# EasyEDA Pro project PCB_Project.eprj

# Schematic Schematic1
Create Date: 2023-12-18; Page Name: P1; Project Name: PCB_Project; Schematic Name: Schematic1; Update Date: 2023-12-18; Company: 嘉立创EDA; Page Size: A4; Version: V1.0
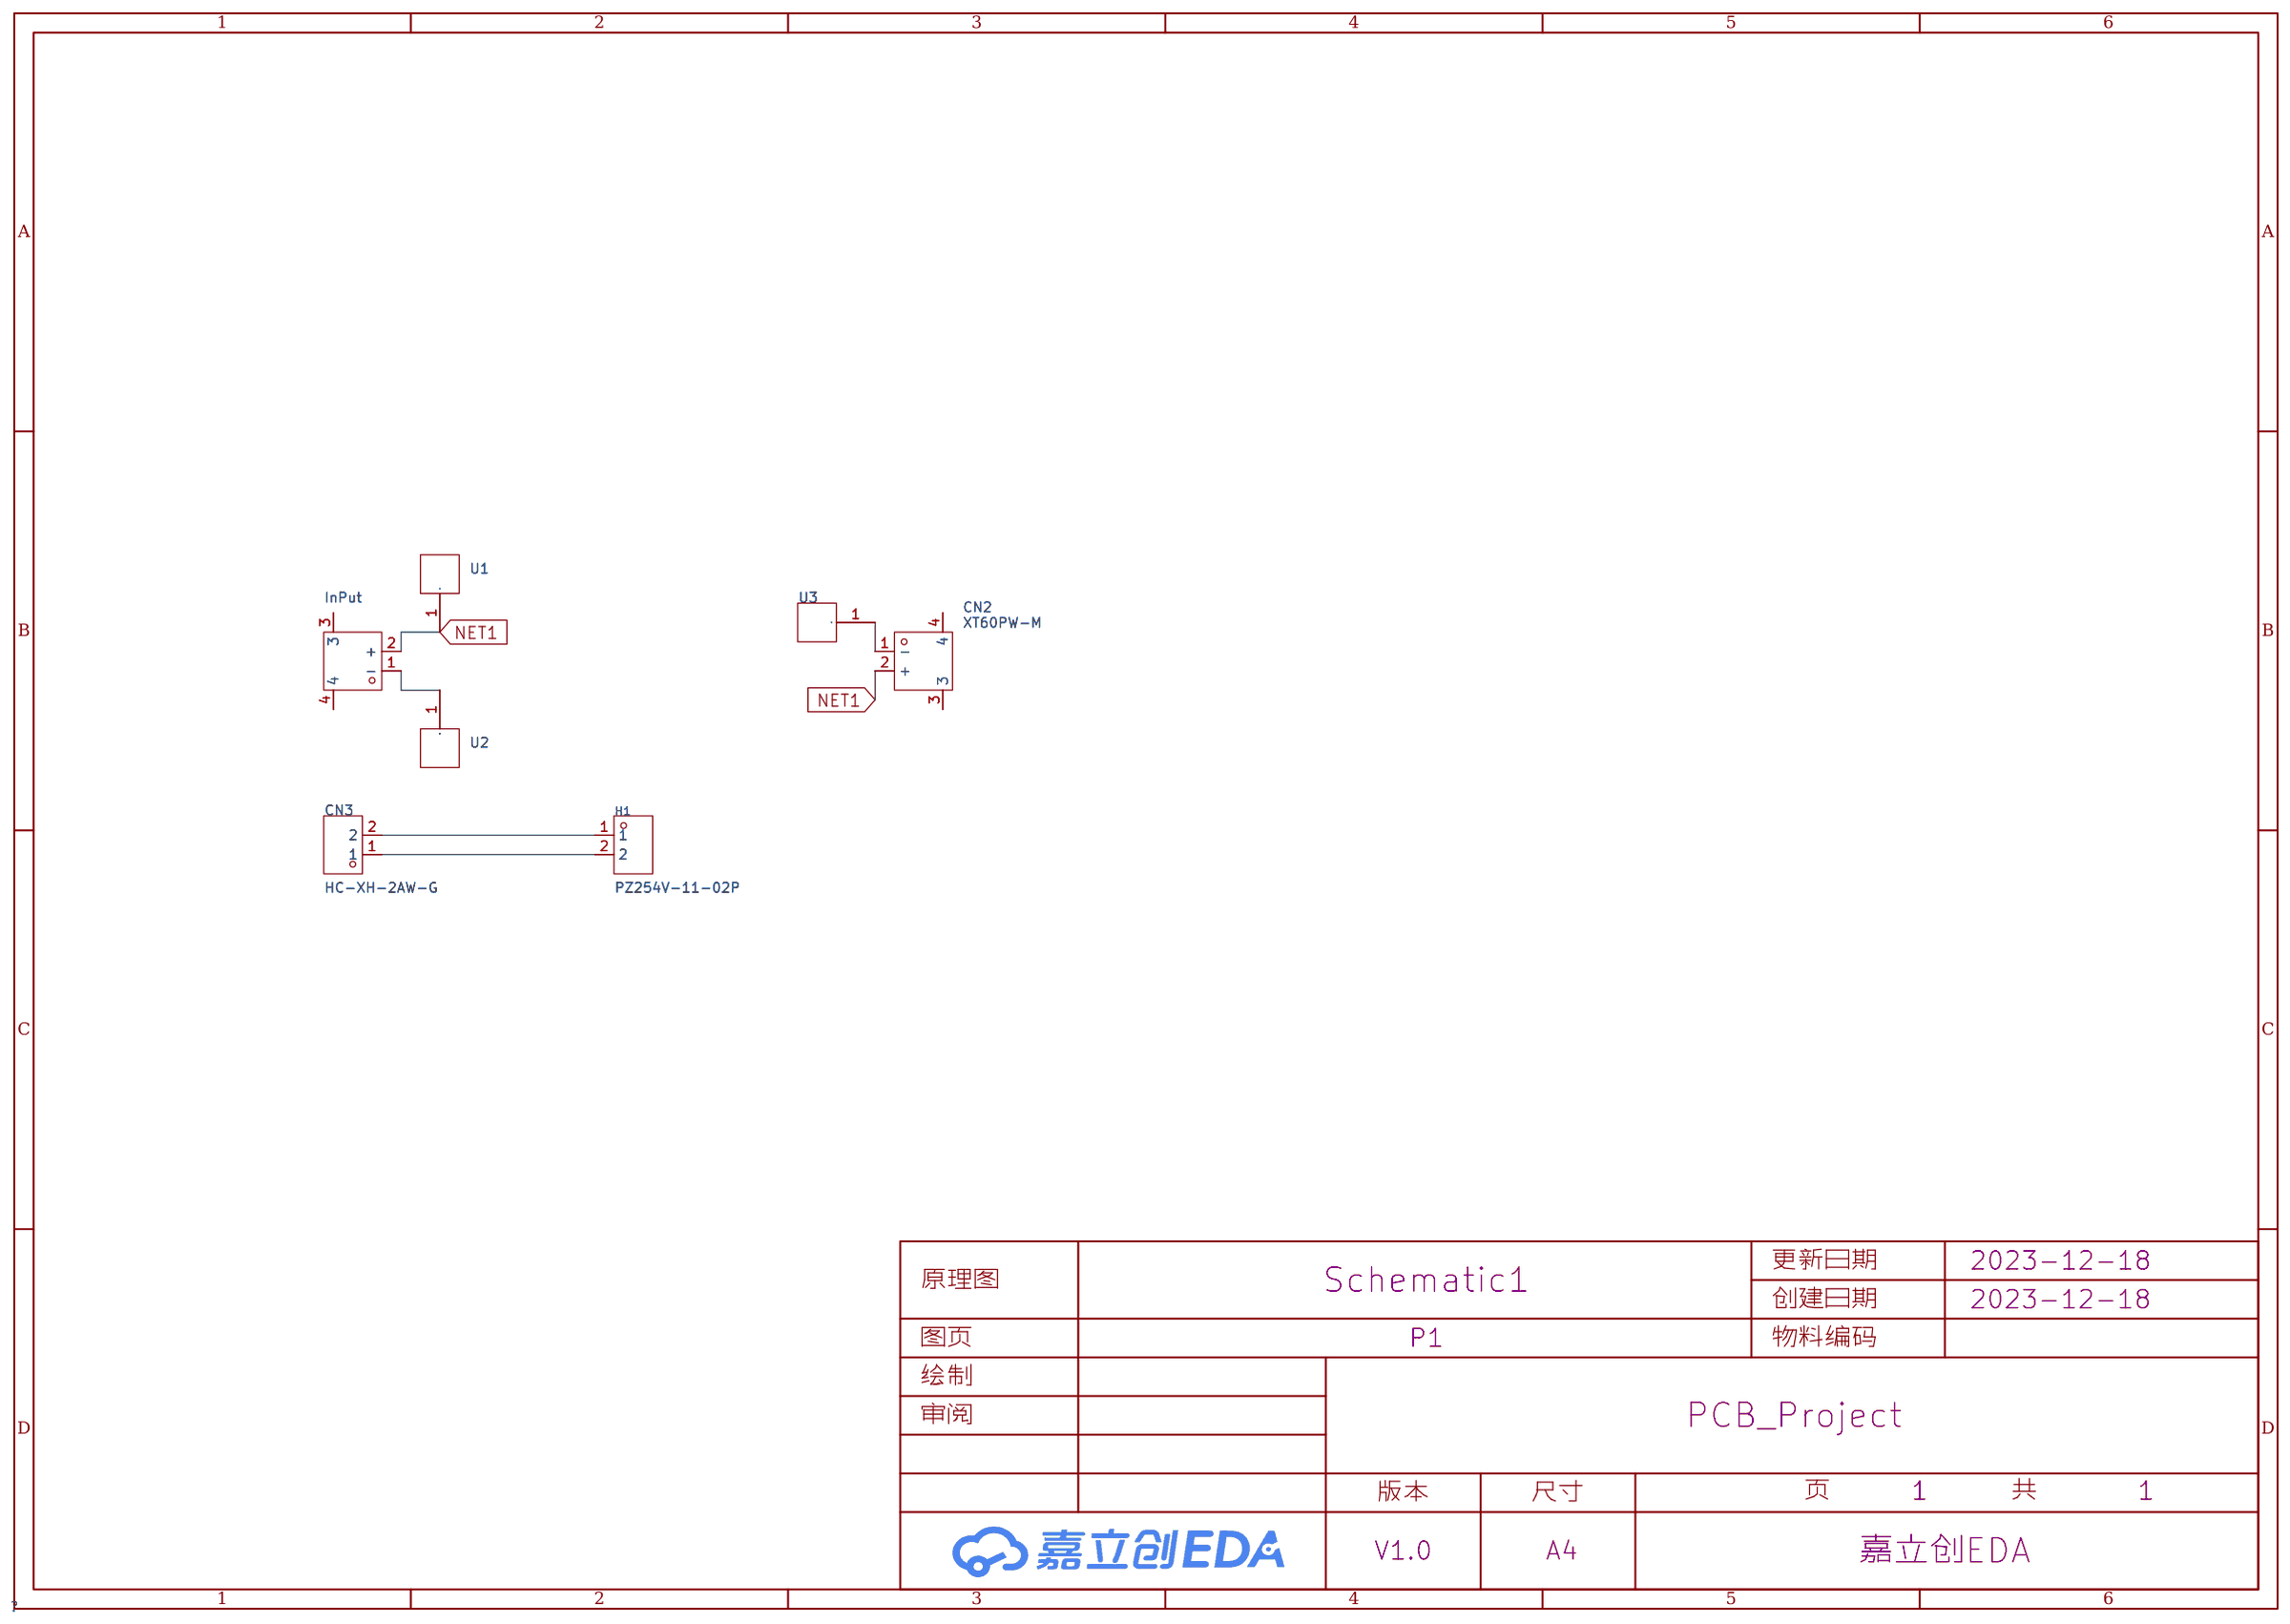
[diagram p0: schematic sheet]

## Parts
CN2  XT60PW-M  [CONN-TH_XT60PW-M]
CN3  HC-XH-2AW-G  [CONN-TH_2P-P2.50_HC-XH-2AW-G]
H1  PZ254V-11-02P  [HDR-TH_2P-P2.54-V-M]
InPut  XT60PW-M  [CONN-TH_XT60PW-M]
U1  -  [过孔焊盘(1Px3mm)]
U2  -  [过孔焊盘(1Px3mm)]
U3  -  [过孔焊盘(1Px3mm)]

## Library data of the parts
CN2 InPut = XT60PW-M: 类别:-;类型1:-;; LCSC Part Name: AMASS(艾迈斯)航模插头xt60连接器150公母对接pw锂电池公头 板插卧式XT60PW-M; Supplier Part: C98732; Manufacturer: AMASS(艾迈斯); JLCPCB Part Class: 扩展库; Datasheet: https://atta.szlcsc.com/upload/public/pdf/source/20190916/C428722_DFF78979486FCB0B58C1FC563067EC88.pdf; Supplier: LCSC; Brand: 艾迈斯; Type: 卧式插头; Colour: 黄色; InterfaceType: 公头
CN3 = HC-XH-2AW-G: 插针结构:1x2P;间距:2.54mm;安装方式:弯插;行距:2.54mm;总PIN数:2P;排数:1;每排PIN数:2;参考系列:XH;额定电流:3A;工作温度范围:-25℃~+85℃;; LCSC Part Name: 1x2P 间距:2.54mm 弯插 系列:XH; Supplier Part: C5341208; Manufacturer: HCTL(华灿天禄); Supplier Footprint: 弯插,P=2.5mm; JLCPCB Part Class: 扩展库; Datasheet: https://atta.szlcsc.com/upload/public/pdf/source/20230711/B565BAF3B11666EF6B81B3605408F2BD.pdf; Supplier: LCSC; Pins Structure: 1x2P; Pitch: 2.54mm; Mounting Style: 弯插; Row Spacing: 2.54mm; Number of Pins: 2P; Number of Rows: 1; Number of PINs Per Row: 2; Reference Series: XH; Current Rating (Max): 3A; Operating Temperature Range: -25℃~+85℃
H1 = PZ254V-11-02P: 排数:单排;总PIN位数:2P;间距:2.54mm;插针结构:1x2P;行距:-;安装类型:直插;圆针/方针:方针;额定电流:-;额定电压:-;配合针长度:6mm;塑高:2.5mm;端接针长度:3mm;触头材质:黄铜;触头镀层:-;工作温度范围:-40℃~+105℃;颜色:黑色;; LCSC Part Name: 2.54mm 1x2P 直插 方针; Supplier Part: C492401; Manufacturer: XFCN(兴飞); Supplier Footprint: 插件,P=2.54mm; JLCPCB Part Class: 扩展库; Datasheet: https://atta.szlcsc.com/upload/public/pdf/source/20200309/C492401_A812433581A9B211A7FFA413ADDFF0E5.pdf; Supplier: LCSC; Number of Rows: 单排; Number of Pins: 2P; Pitch: 2.54mm; Pin Structure: 1x2P; Mounting Type: 直插; Circluar Pins/Square Pins: 方针; Length of Mating Pin: 6mm; Insulation Height: 2.5mm; Length of End Connection Pin: 3mm; Contact Material: 黄铜; Operating Temperature Range: -40℃~+105℃; Color: 黑色
U1-U3 = 过孔焊盘(1Px3mm)

## Nets
NET1: CN2.2(+) InPut.2(+) U1.1
$1N274: InPut.1(-) U2.1
$1N486: CN3.2 H1.1
$1N489: CN3.1 H1.2
Net-(CN2-1): CN2.1(-) U3.1

Not connected (* = marked no-connect by the designer): CN2 3 4; InPut 3 4

# Board PCB1
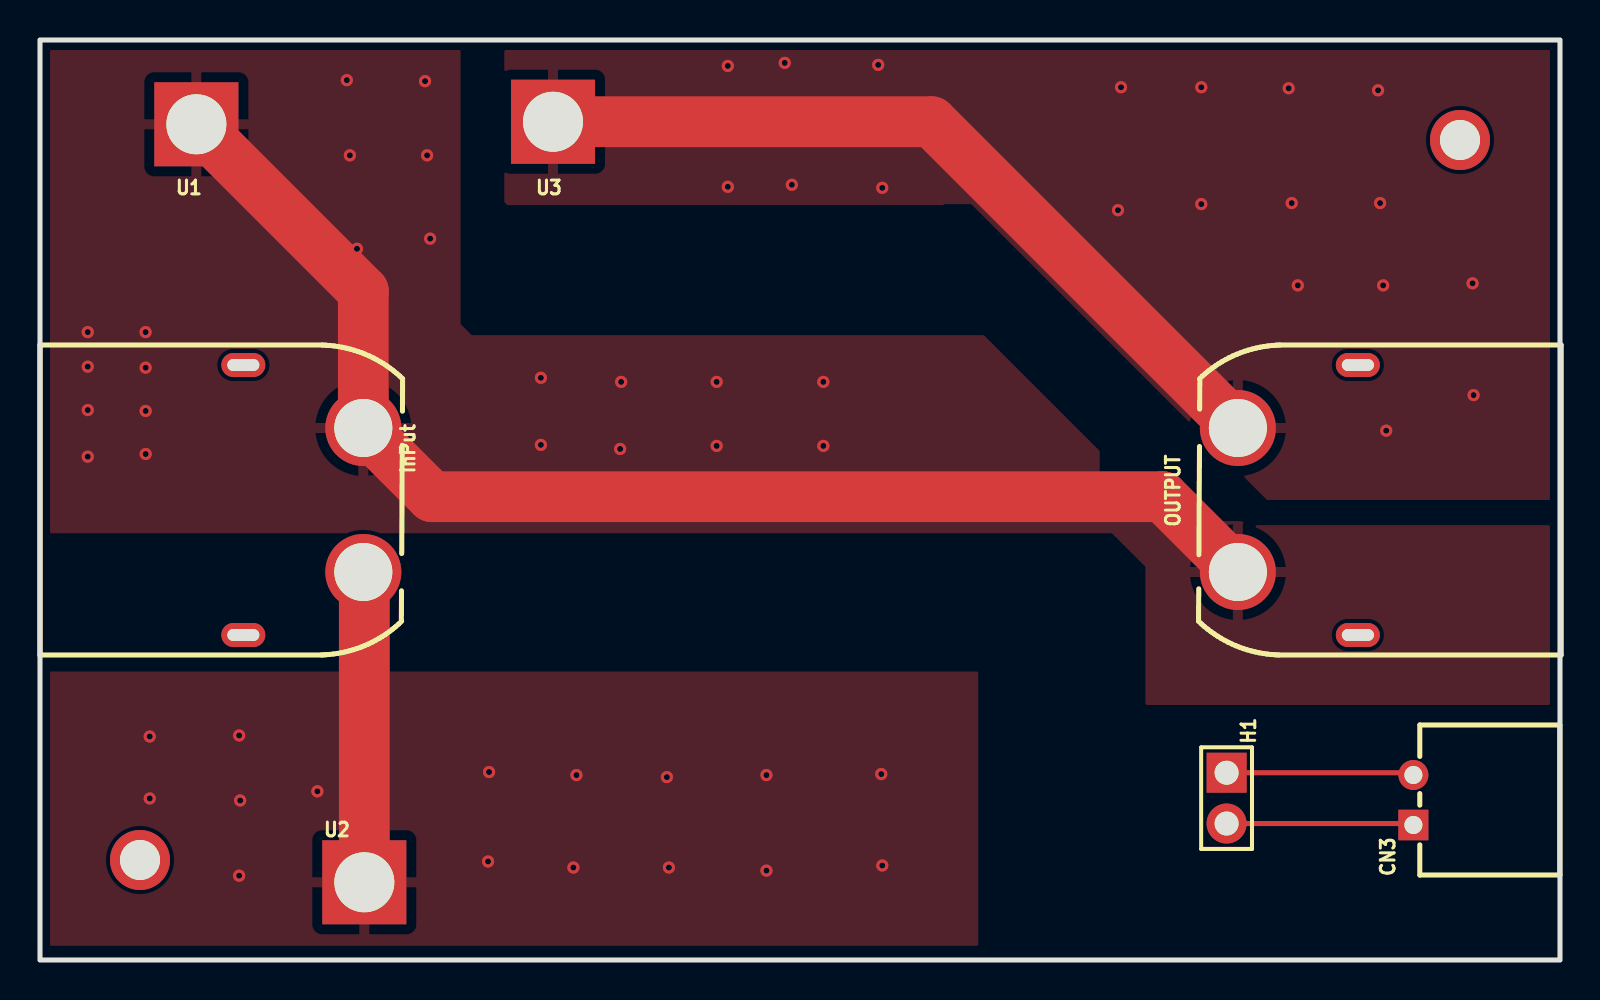
[diagram p1: board, top side]
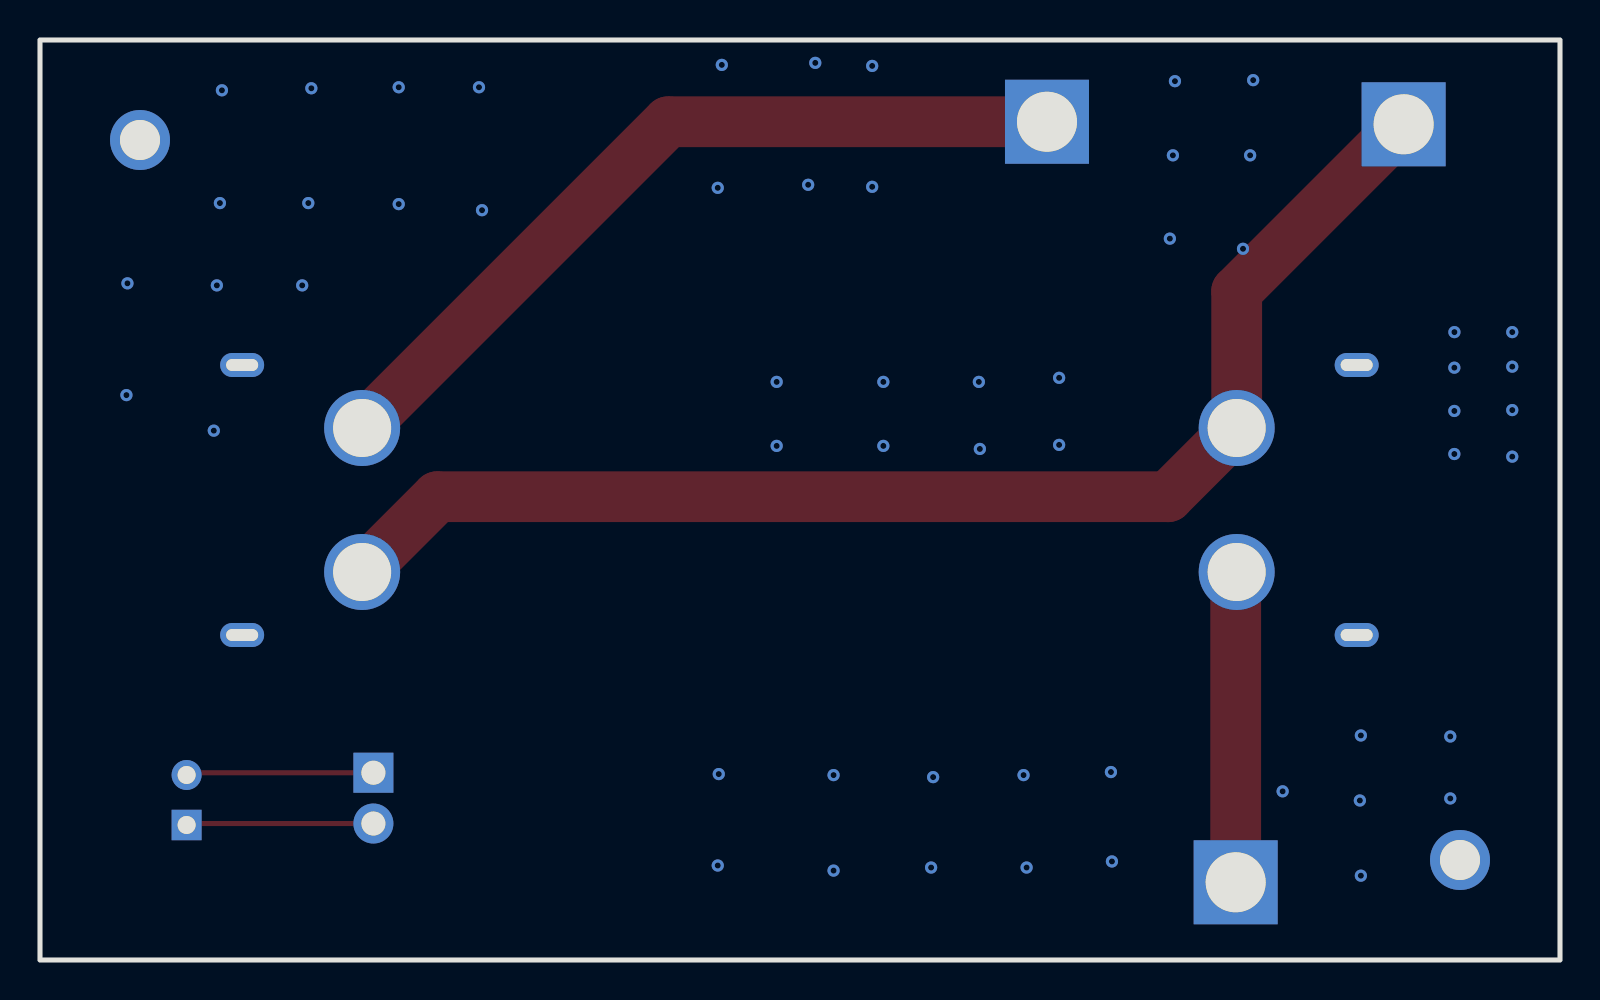
[diagram p2: board, bottom side, seen from below]

Outline 76 x 46 mm; copper layers: Top Layer, Bottom Layer. Coordinates in mm from the lower left corner of the outline.
Outline path: rectangle 0,46 76,0
Stack: Top Layer 0.035mm / Dielectric1 1.51mm FR4 er 4.5 / Bottom Layer 0.035mm

## Design rules (mm)
template: JLCPCB Capability(Two Layers Board)
spacing copperThickness1oz (default): track to track 0.102, other pairs 0.152 to 0.3
spacing copperThickness2oz: track to track 0.203, other pairs 0.152 to 0.3
track width copperThickness1oz (default): min 0.127, default 0.254, max 2.54
track width copperThickness2oz: min 0.203, default 0.254, max 2.54
differential pair differentialPair (default): width min 0.127, default 0.254, max 2.54; gap min 0.152, default 0.152
via viaSize (default): diameter min 0.5, default 0.61, max 10; hole min 0.3, default 0.305, max 6.3

## Placement (name value [footprint] x y rotation side)
CN3  HC-XH-2AW-G  [CONN-TH_2P-P2.50_HC-XH-2AW-G]  68.67 8 90 top
H1  PZ254V-11-02P  [HDR-TH_2P-P2.54-V-M]  59.33 8.09 270 top
InPut  XT60PW-M  [CONN-TH_XT60PW-M]  13.17 23 0 top
NOREF  -  [Pad_e192]  71 41 0 top
NOREF#2  -  [Pad_e184]  5 5 0 top
OUTPUT  XT60PW-M  [CONN-TH_XT60PW-M]  62.89 23 180 top
U1  -  [过孔焊盘(1Px3mm)]  7.82 41.79 0 top
U2  -  [过孔焊盘(1Px3mm)]  16.22 3.89 0 top
U3  -  [过孔焊盘(1Px3mm)]  25.65 41.91 0 top

## Footprints (pads in the part's own frame, mm; a bottom-side part is the same pattern mirrored in y, then rotated)
CONN-TH_2P-P2.50_HC-XH-2AW-G
  rect 1.524x1.5 hole 0.9: 1(-1.25,0)
  round 1.5 hole 0.9: 2(1.25,0)
CONN-TH_XT60PW-M
  round 3.8 hole 2.9: 1(3,-3.6) 2(3,3.6)
  oval 2.2x1.2 hole 1.6x0.6: 3(-3,6.75) 4(-3,-6.75)
HDR-TH_2P-P2.54-V-M
  rect 2x2 hole 1.2: 1(-1.27,0)
  round 2 hole 1.2: 2(1.27,0)
Pad_e184
  round 3 hole 2: 5(0,0)
Pad_e192
  round 3 hole 2: 5(0,0)
过孔焊盘(1Px3mm)
  rect 4.2x4.2 hole 3: 1(0,0)

## Nets
NET1: InPut.2 OUTPUT.2 U1.1
$1N270: OUTPUT.1 U3.1
$1N274: InPut.1 U2.1
$1N486: CN3.2 H1.1
$1N489: CN3.1 H1.2

Pads without a net: InPut 3 4; NOREF 5; NOREF#2 5; OUTPUT 3 4

## Via types
v1: diameter 0.61, hole 0.305, Top Layer to Bottom Layer, 57 vias

## Routing (per net, layer and track width the routed paths; a pad name or vN(x,y) marks a point on that pad's centre or on a via; arc(x,y) is an arc through that point)
NET1: length 65.4
  Top Layer w2.54: U1.1 16.17,33.44 InPut.2 19.6,23.17 56.13,23.17 OUTPUT.2
  vias: v1(2.39,31.39) v1(2.39,29.67) v1(2.39,27.5) v1(2.39,25.17) v1(5.28,31.39) v1(5.28,29.62) v1(5.28,27.45) v1(5.28,25.3) v1(15.34,43.99) v1(15.49,40.23) v1(15.85,35.56) v1(19.25,43.94) v1(19.35,40.23) v1(19.51,36.07) v1(25.04,29.11) v1(25.04,25.76) v1(29.01,25.55) v1(29.06,28.91) v1(33.83,28.91) v1(33.83,25.7) v1(39.17,28.91) v1(39.17,25.7)
$1N270: length 40.6
  Top Layer w2.54: U3.1 44.58,41.91 OUTPUT.1
  vias: v1(34.39,44.7) v1(34.39,38.66) v1(37.24,44.86) v1(37.59,38.76) v1(41.91,44.75) v1(42.11,38.61) v1(53.9,37.49) v1(54.05,43.64) v1(58.06,43.64) v1(58.06,37.8) v1(62.43,43.59) v1(62.59,37.85) v1(62.89,33.73) v1(66.9,43.48) v1(67,37.85) v1(67.16,33.73) v1(67.31,26.47) v1(71.63,33.83) v1(71.68,28.25)
$1N274: length 15.5
  Top Layer w2.54: U2.1 16.22,19.35 InPut.1
  vias: v1(5.49,11.18) v1(5.49,8.08) v1(9.96,11.23) v1(10.01,7.98) v1(9.96,4.22) v1(13.87,8.43) v1(22.4,4.93) v1(22.45,9.4) v1(26.67,4.62) v1(26.82,9.25) v1(31.34,9.14) v1(31.44,4.62) v1(36.32,9.25) v1(36.32,4.47) v1(42.06,9.3) v1(42.11,4.72)
$1N486: length 9.4
  Top Layer w0.254: CN3.2 68.56,9.36 H1.1
$1N489: length 9.4
  Top Layer w0.254: CN3.1 68.6,6.82 H1.2

## Copper pours and planes (outline as drawn; the poured copper is in the pictures)
NET1 on Top Layer: -5.03,50.24 -5.03,25.55 -0.81,21.34 53.59,21.34 55.27,19.66 55.27,12.75 79.1,12.75 79.1,20.78 78.13,21.74 60.3,21.74 60.1,21.95 56.59,21.95 56.54,22 53.8,22 52.98,22.81 52.98,25.45 47.19,31.24 21.59,31.24 21.03,31.8 21.03,47.85 18.29,50.59 -4.68,50.59
$1N270 on Top Layer: 23.22,48.92 23.22,37.9 23.37,37.74 45.16,37.74 45.21,37.8 46.56,37.8 61.35,23 75.45,23 75.74,22.71 75.74,46.48 73.3,48.92
$1N274 on Top Layer: -2.54,14.43 46.92,14.43 46.92,0.71 -0.05,0.71 -2.54,3.2
